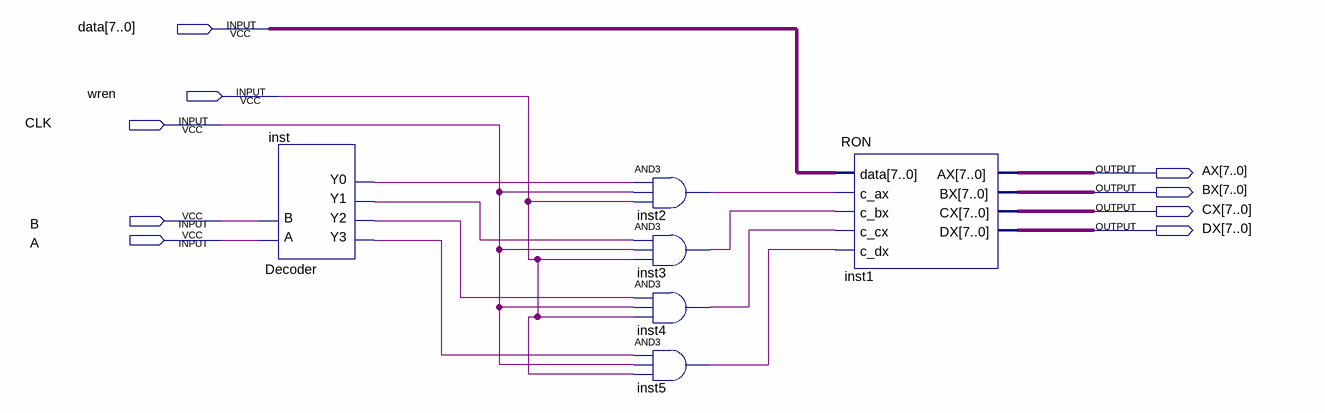
[diagram p0: schematic sheet]
// Quartus schematic RONWren.bdf as structural Verilog: 6 symbols, 9 pins
module RONWren (
  input  [7:0] data,
  input  wren,
  input  CLK,
  input  B,
  input  A,
  output [7:0] AX,
  output [7:0] BX,
  output [7:0] CX,
  output [7:0] DX
);

  wire inst2_out, inst3_out, inst4_out, inst5_out, inst_y0, inst_y1, inst_y2, inst_y3;

  Decoder inst (.A(A), .B(B), .Y3(inst_y3), .Y2(inst_y2), .Y1(inst_y1), .Y0(inst_y0));
  and inst2 (inst2_out, inst_y0, CLK, wren);
  and inst3 (inst3_out, inst_y1, CLK, wren);
  and inst4 (inst4_out, inst_y2, CLK, wren);
  and inst5 (inst5_out, inst_y3, CLK, wren);
  RON inst1 (
    .data(data), .c_ax(inst2_out), .c_bx(inst3_out), .c_cx(inst4_out), .c_dx(inst5_out), .AX(AX), .BX(BX),
    .CX(CX), .DX(DX));
endmodule
